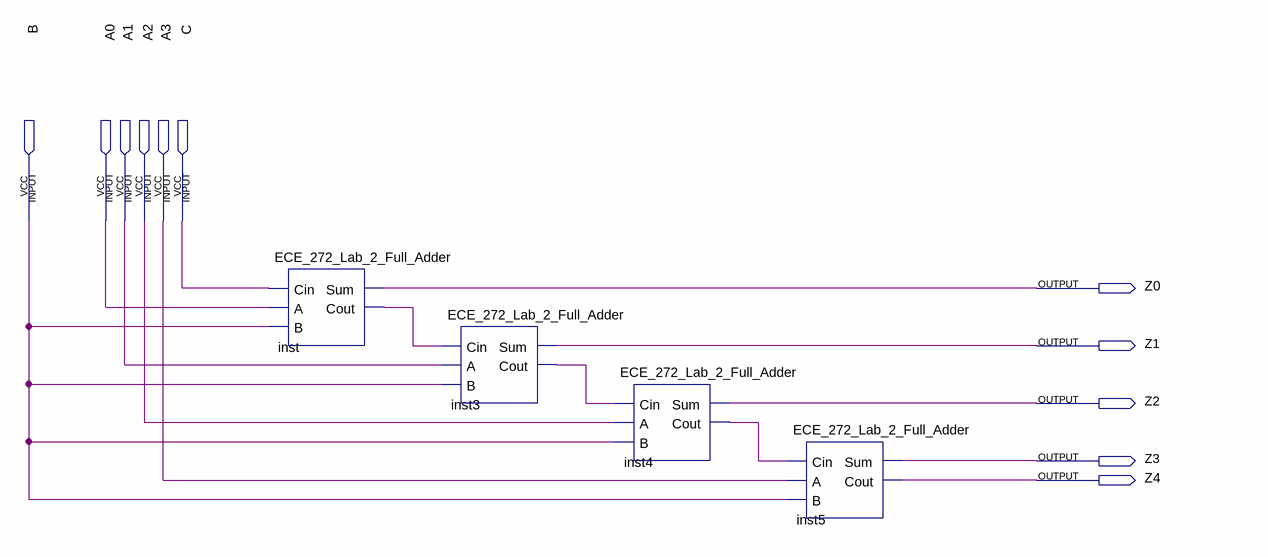
[diagram p0: schematic sheet]
// Quartus schematic Adder.bdf as structural Verilog: 4 symbols, 11 pins
module Adder (
  input  B,
  input  A0,
  input  A1,
  input  A2,
  input  A3,
  input  C,
  output Z0,
  output Z1,
  output Z2,
  output Z3,
  output Z4
);

  wire inst3_cout, inst4_cout, inst_cout;

  ECE_272_Lab_2_Full_Adder inst (.Cin(C), .A(A0), .B(B), .Sum(Z0), .Cout(inst_cout));
  ECE_272_Lab_2_Full_Adder inst3 (.Cin(inst_cout), .A(A1), .B(B), .Sum(Z1), .Cout(inst3_cout));
  ECE_272_Lab_2_Full_Adder inst4 (.Cin(inst3_cout), .A(A2), .B(B), .Sum(Z2), .Cout(inst4_cout));
  ECE_272_Lab_2_Full_Adder inst5 (.Cin(inst4_cout), .A(A3), .B(B), .Sum(Z3), .Cout(Z4));
endmodule
